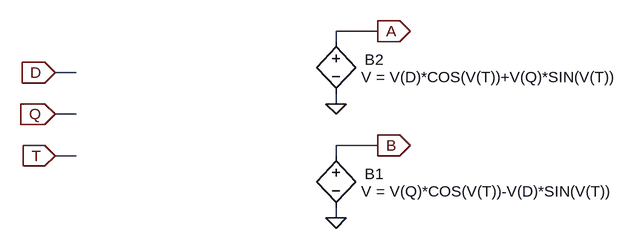
[diagram p0: schematic inv_park.asc]
inv_park.asc, the LTspice schematic file:
Version 4
SHEET 1 892 680
WIRE 272 -16 208 -16
WIRE 208 0 208 -16
WIRE -192 48 -224 48
WIRE 208 96 208 80
WIRE -192 112 -224 112
WIRE 272 160 208 160
WIRE -192 176 -224 176
WIRE 208 176 208 160
WIRE 208 272 208 256
FLAG -224 48 D
IOPIN -224 48 In
FLAG -224 112 Q
IOPIN -224 112 In
FLAG 208 272 0
FLAG 272 160 B
IOPIN 272 160 Out
FLAG 208 96 0
FLAG 272 -16 A
IOPIN 272 -16 Out
FLAG -224 176 T
IOPIN -224 176 In
SYMBOL bv 208 160 R0
WINDOW 0 44 44 Left 2
WINDOW 3 39 71 Left 2
SYMATTR InstName B1
SYMATTR Value V = V(Q)*COS(V(T))-V(D)*SIN(V(T))
SYMBOL bv 208 -16 R0
WINDOW 0 44 44 Left 2
WINDOW 3 39 71 Left 2
SYMATTR InstName B2
SYMATTR Value V = V(D)*COS(V(T))+V(Q)*SIN(V(T))

The netlist it stands for:
* inv_park.asc
B1 B 0 V = V(Q)*COS(V(T))-V(D)*SIN(V(T))
B2 A 0 V = V(D)*COS(V(T))+V(Q)*SIN(V(T))
.backanno
.end